# Altium schematic sheet Connectors.SchDoc
size A4
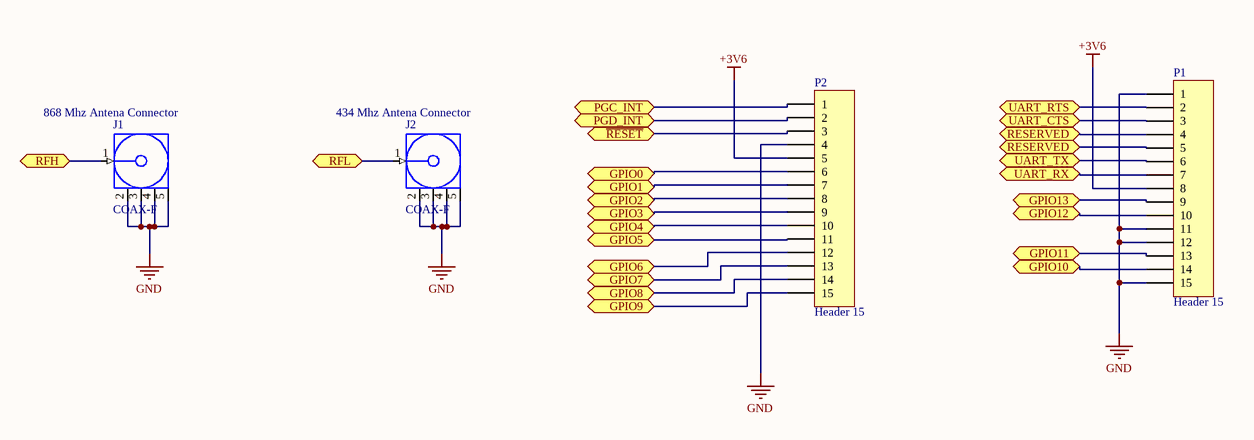
[diagram p0: Connectors.SchDoc]

## Parts
J1  COAX-F  [MCX5.08-H5]
J2  COAX-F  [MCX5.08-H5]
P1  Header 15  [HDR1X15]
P2  Header 15  [HDR1X15]

## Ports
GPIO0, GPIO1, GPIO2, GPIO3, GPIO4, GPIO5, GPIO6, GPIO7, GPIO8, GPIO9, GPIO10, GPIO11, GPIO12, GPIO13, PGC_INT, PGD_INT, RESERVED, RFH, RFL, UART_CTS, UART_RTS, UART_RX, UART_TX, ~{RESET}

## Nets
+3V6: P1.8 P2.5
GND: J1.2(GND) J1.3(GND) J1.4(GND) J1.5(GND) J2.2(GND) J2.3(GND) J2.4(GND) J2.5(GND) P1.1 P1.11 P1.12 P1.15 P2.4
GPIO0: P2.6 ; port GPIO0
GPIO1: P2.7 ; port GPIO1
GPIO2: P2.8 ; port GPIO2
GPIO3: P2.9 ; port GPIO3
GPIO4: P2.10 ; port GPIO4
GPIO5: P2.11 ; port GPIO5
GPIO6: P2.12 ; port GPIO6
GPIO7: P2.13 ; port GPIO7
GPIO8: P2.14 ; port GPIO8
GPIO9: P2.15 ; port GPIO9
GPIO10: P1.14 ; port GPIO10
GPIO11: P1.13 ; port GPIO11
GPIO12: P1.10 ; port GPIO12
GPIO13: P1.9 ; port GPIO13
PGC_INT: P2.1 ; port PGC_INT
PGD_INT: P2.2 ; port PGD_INT
~{RESET}: P2.3 ; port ~{RESET}
RESERVED: P1.4 P1.5 ; port RESERVED
RFH: J1.1(Signal) ; port RFH
RFL: J2.1(Signal) ; port RFL
UART_CTS: P1.3 ; port UART_CTS
UART_RTS: P1.2 ; port UART_RTS
UART_RX: P1.7 ; port UART_RX
UART_TX: P1.6 ; port UART_TX

## Notes on the sheet
- (near J1) 868 Mhz Antena Connector
- (near J2) 434 Mhz Antena Connector

## Library data of the parts
J1 J2 = COAX-F: RF Coaxial PCB Connector, MCX; Thru-Hole, Right-Angle Mount Socket, Blunt Post Terminal, 50 Ohm Impedance; PCB_Layout: Complies with manufacturer's recommendation.; DrillSize: Corresponds to nominal value.; Published: 15-Jul-2004; LatestRevisionDate: 15-Jul-2004; LatestRevisionNote: Component Replaced.; DatasheetDocument: 30-May-2003; PackageDocument: 04-Jul-1999; PackageReference: 919-119J-51AX; Publisher: Altium Limited; ComponentLink1Description: Manufacturer Link; ComponentLink1URL: http://www.amphenolrf.com/
P1 P2 = Header 15: Header, 15-Pin; LatestRevisionDate: 17-Jul-2002; LatestRevisionNote: Re-released for DXP Platform.; Publisher: Altium Limited